# EAGLE schematic M7105B (EAGLE 6.6.0)

## Sheet 1 of 4
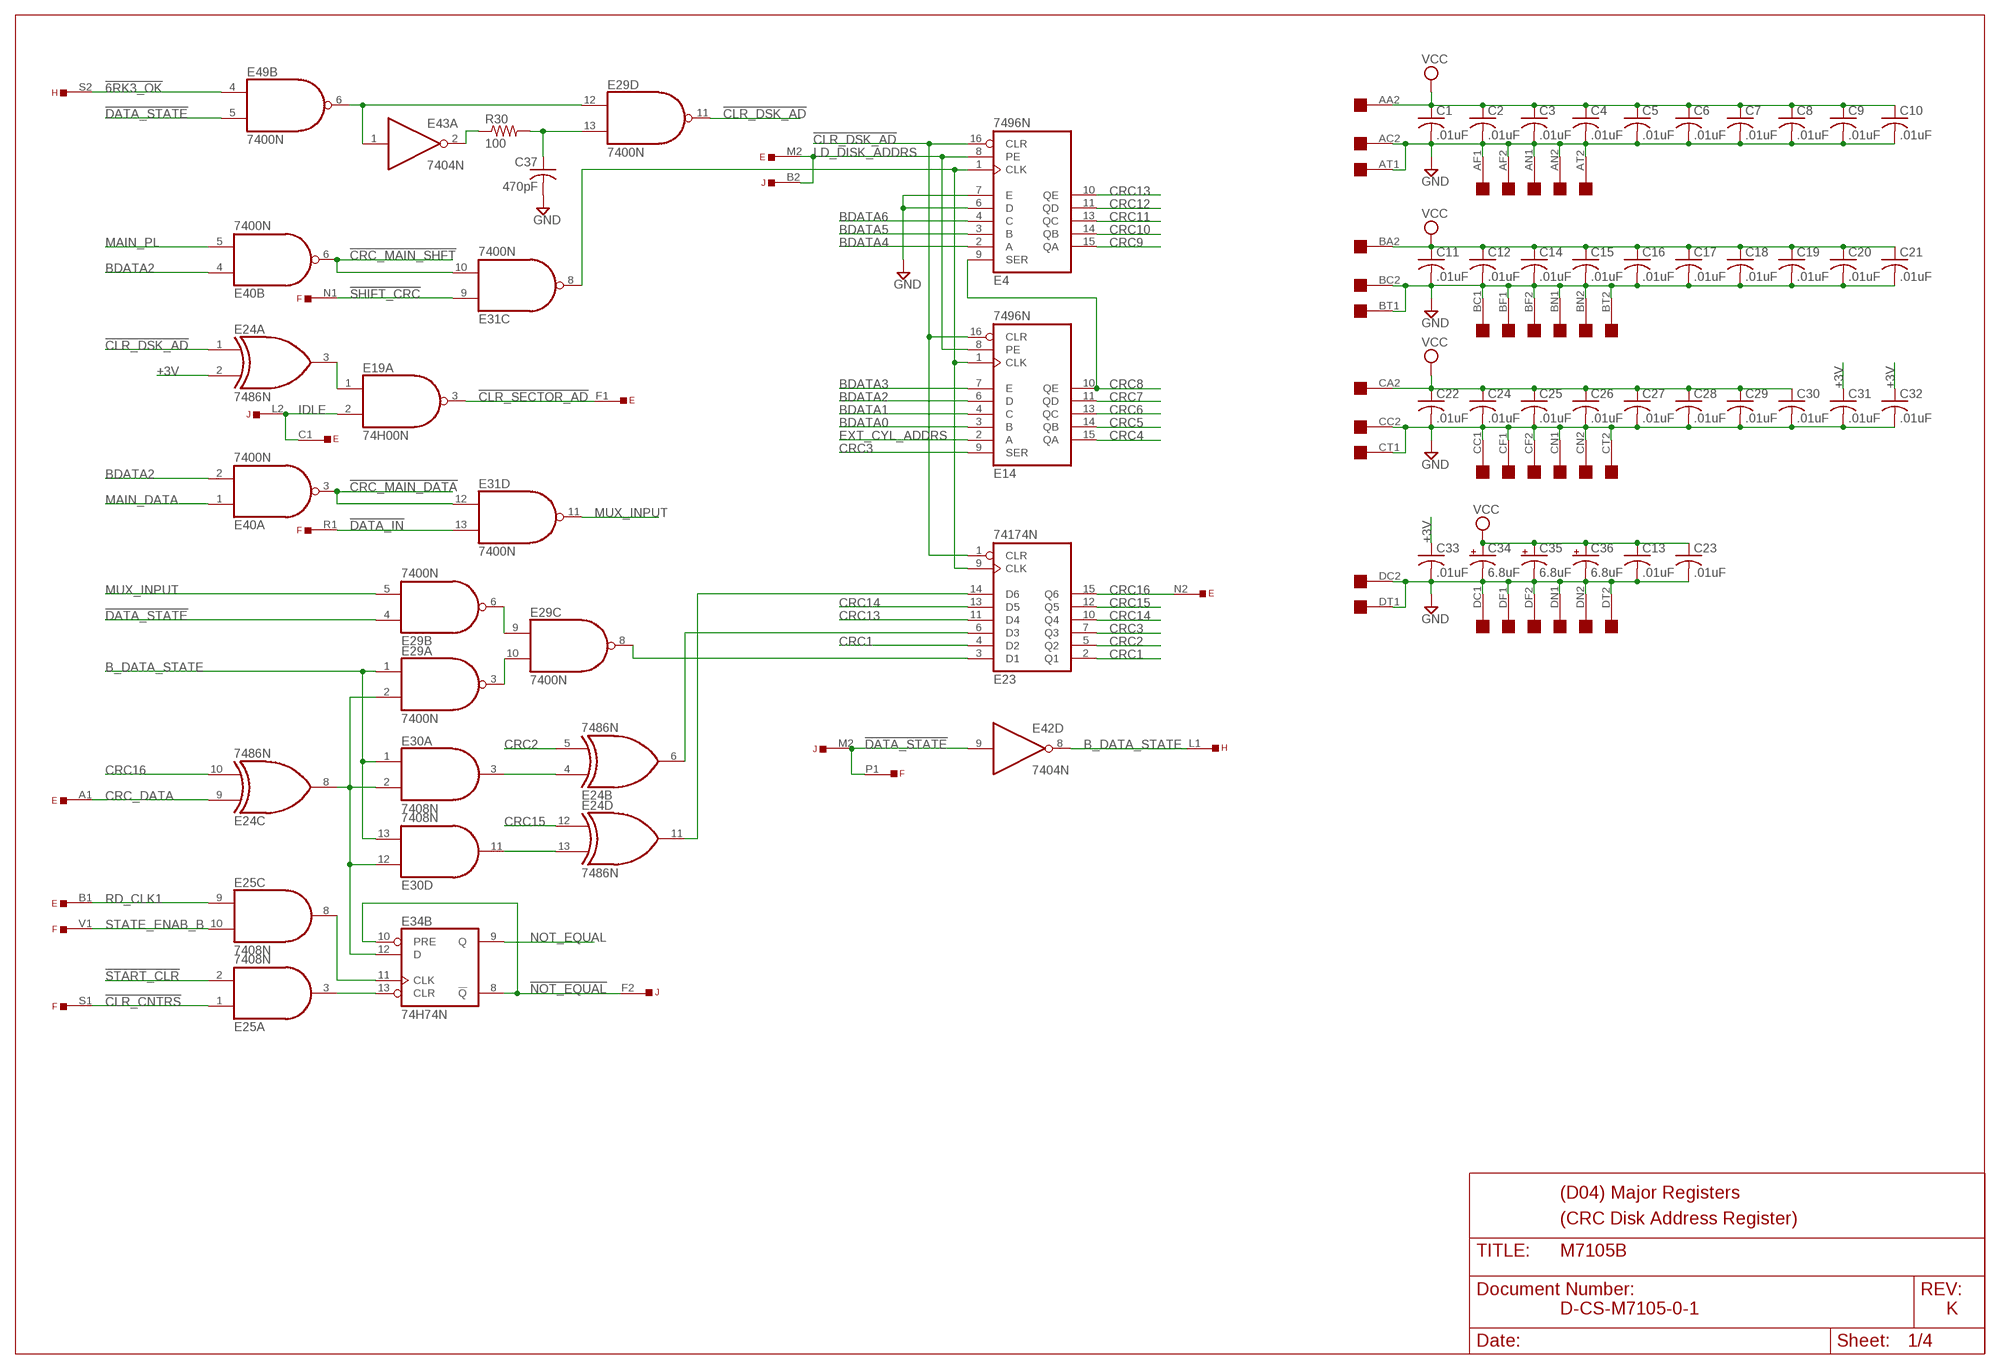
[diagram p0: schematic, sheet 1]

### Parts
C1  .01uF  C-US  [C063-025X075]
C2  .01uF  C-US  [C063-025X075]
C3  .01uF  C-US  [C063-025X075]
C4  .01uF  C-US  [C063-025X075]
C5  .01uF  C-US  [C063-025X075]
C6  .01uF  C-US  [C063-025X075]
C7  .01uF  C-US  [C063-025X075]
C8  .01uF  C-US  [C063-025X075]
C9  .01uF  C-US  [C063-025X075]
C10  .01uF  C-US  [C063-025X075]
C11  .01uF  C-US  [C063-025X075]
C12  .01uF  C-US  [C063-025X075]
C13  .01uF  C-US  [C063-025X075]
C14  .01uF  C-US  [C063-025X075]
C15  .01uF  C-US  [C063-025X075]
C16  .01uF  C-US  [C063-025X075]
C17  .01uF  C-US  [C063-025X075]
C18  .01uF  C-US  [C063-025X075]
C19  .01uF  C-US  [C063-025X075]
C20  .01uF  C-US  [C063-025X075]
C21  .01uF  C-US  [C063-025X075]
C22  .01uF  C-US  [C063-025X075]
C23  .01uF  C-US  [C063-025X075]
C24  .01uF  C-US  [C063-025X075]
C25  .01uF  C-US  [C063-025X075]
C26  .01uF  C-US  [C063-025X075]
C27  .01uF  C-US  [C063-025X075]
C28  .01uF  C-US  [C063-025X075]
C29  .01uF  C-US  [C063-025X075]
C30  .01uF  C-US  [C063-025X075]
C31  .01uF  C-US  [C063-025X075]
C32  .01uF  C-US  [C063-025X075]
C33  .01uF  C-US  [C063-025X075]
C34  6.8uF  CPOL-USE20-8AXIAL  [E12-8]
C35  6.8uF  CPOL-USE20-8AXIAL  [E12-8]
C36  6.8uF  CPOL-USE20-8AXIAL  [E12-8]
C37  470pF  C-US  [C063-025X075]
E  EDGE-TOP  [EDGE-CON2]
E4  7496N  74LS96N  [DIL16]
E14  7496N  74LS96N  [DIL16]
E19  74H00N  74S00N  [DIL14]
E23  74174N  [DIL16]
E24  7486N  [DIL14]
E25  7408N  74S08N  [DIL14]
E29  7400N  [DIL14]
E30  7408N  74S08N  [DIL14]
E31  7400N  [DIL14]
E34  74H74N  74S74N  [DIL14]
E40  7400N  [DIL14]
E42  7404N  [DIL14]
E43  7404N  [DIL14]
E49  7400N  [DIL14]
F  EDGE-TOP  [EDGE-CON2]
H  EDGE-TOP  [EDGE-CON2]
J  EDGE-TOP  [EDGE-CON2]
OMNIBUS  QUAD  [EDGE-CON8]
R30  100  R-US_0207/10  [0207/10]

### Nets
!6RK3_OK: E49.4(B:I0) H.S2
!CLR_CNTRS: E25.1(A:I0) F.S1
!CLR_DSK_AD: E4.16(CLR) E14.16(CLR) E23.1(CLR) E24.1(A:I0) E29.11(D:O)
!CLR_SECTOR_AD: E19.3(A:O) E.F1
!CRC_MAIN_DATA: E31.12(D:I0) E40.3(A:O)
!CRC_MAIN_SHFT: E31.10(C:I1) E40.6(B:O)
!DATA_IN: E31.13(D:I1) F.R1 ; also sheet 2
!DATA_STATE: E29.4(B:I0) E42.9(D:I) E49.5(B:I1) F.P1 J.M2
!NOT_EQUAL: E34.8(B:!Q) E34.10(B:PRE) J.F2
!SHIFT_CRC: E31.9(C:I0) F.N1
!START_CLR: E25.2(A:I1) ; also sheet 3
+3V: C31.1 C32.1 C33.1 E24.2(A:I1) ; also sheet 2,3
B_DATA_STATE: E29.1(A:I0) E30.1(A:I0) E30.13(D:I1) E42.8(D:O) H.L1
BDATA0: E14.3(B) ; also sheet 2,3
BDATA1: E14.4(C) ; also sheet 2,3
BDATA2: E14.6(D) E40.2(A:I1) E40.4(B:I0) ; also sheet 2,3
BDATA3: E14.7(E) ; also sheet 2,3
BDATA4: E4.2(A) ; also sheet 2,3
BDATA5: E4.3(B) ; also sheet 2,3
BDATA6: E4.4(C) ; also sheet 2,3
CRC1: E23.2(Q1) E23.4(D2)
CRC2: E23.5(Q2) E24.5(B:I1)
CRC3: E14.9(SER) E23.7(Q3)
CRC4: E14.15(QA) ; also sheet 4
CRC5: E14.14(QB) ; also sheet 4
CRC6: E14.13(QC) ; also sheet 4
CRC7: E14.11(QD) ; also sheet 4
CRC8: E4.9(SER) E14.10(QE) ; also sheet 4
CRC9: E4.15(QA) ; also sheet 4
CRC10: E4.14(QB) ; also sheet 4
CRC11: E4.13(QC) ; also sheet 4
CRC12: E4.11(QD)
CRC13: E4.10(QE) E23.11(D4)
CRC14: E23.10(Q4) E23.13(D5)
CRC15: E23.12(Q5) E24.12(D:I0)
CRC16: E23.15(Q6) E24.10(C:I1) E.N2 ; also sheet 2
CRC_DATA: E24.9(C:I0) E.A1
EXT_CYL_ADDRS: E14.2(A) ; also sheet 2
GND [supply]: C1.2 C2.2 C3.2 C4.2 C5.2 C6.2 C7.2 C8.2 C9.2 C10.2 C11.2 C12.2 C13.2 C14.2 C15.2 C16.2 C17.2 C18.2 C19.2 C20.2 C21.2 C22.2 C23.2 C24.2 C25.2 C26.2 C27.2 C28.2 C29.2 C30.2 C31.2 C32.2 C33.2 C34.- C35.- C36.- C37.2 E4.6(D) E4.7(E) OMNIBUS.AC2 OMNIBUS.AF1 OMNIBUS.AF2 OMNIBUS.AN1 OMNIBUS.AN2 OMNIBUS.AT1 OMNIBUS.AT2 OMNIBUS.BC1 OMNIBUS.BC2 OMNIBUS.BF1 OMNIBUS.BF2 OMNIBUS.BN1 OMNIBUS.BN2 OMNIBUS.BT1 OMNIBUS.BT2 OMNIBUS.CC1 OMNIBUS.CC2 OMNIBUS.CF1 OMNIBUS.CF2 OMNIBUS.CN1 OMNIBUS.CN2 OMNIBUS.CT1 OMNIBUS.CT2 OMNIBUS.DC1 OMNIBUS.DC2 OMNIBUS.DF1 OMNIBUS.DF2 OMNIBUS.DN1 OMNIBUS.DN2 OMNIBUS.DT1 OMNIBUS.DT2 ; also sheet 2,3,4
IDLE: E19.2(A:I1) E.C1 J.L2
LD_DISK_ADDRS: E4.8(PE) E14.8(PE) E.M2 J.B2 ; also sheet 3
MAIN_DATA: E40.1(A:I0) ; also sheet 2
MAIN_PL: E40.5(B:I1) ; also sheet 2,3
MUX_INPUT: E29.5(B:I1) E31.11(D:O)
N$2: E4.1(CLK) E14.1(CLK) E23.9(CLK) E31.8(C:O)
N$3: E29.6(B:O) E29.9(C:I0)
N$4: E43.2(A:O) R30.1
N$5: E29.3(A:O) E29.10(C:I1)
N$6: E24.8(C:O) E29.2(A:I1) E30.2(A:I1) E30.12(D:I0) E34.12(B:D)
N$7: E29.12(D:I0) E43.1(A:I) E49.6(B:O)
N$8: C37.1 E29.13(D:I1) R30.2
N$9: E19.1(A:I0) E24.3(A:O)
N$10: E24.4(B:I0) E30.3(A:O)
N$12: E24.13(D:I1) E30.11(D:O)
N$13: E25.3(A:O) E34.13(B:CLR)
N$14: E25.8(C:O) E34.11(B:CLK)
N$17: E23.14(D6) E24.11(D:O)
N$20: E23.6(D3) E24.6(B:O)
N$21: E23.3(D1) E29.8(C:O)
NOT_EQUAL: E34.9(B:Q)
RD_CLK1: E25.9(C:I0) E.B1
STATE_ENAB_B: E25.10(C:I1) F.V1
VCC [supply]: C1.1 C2.1 C3.1 C4.1 C5.1 C6.1 C7.1 C8.1 C9.1 C10.1 C11.1 C12.1 C13.1 C14.1 C15.1 C16.1 C17.1 C18.1 C19.1 C20.1 C21.1 C22.1 C23.1 C24.1 C25.1 C26.1 C27.1 C28.1 C29.1 C30.1 C34.+ C35.+ C36.+ OMNIBUS.AA2 OMNIBUS.BA2 OMNIBUS.CA2 ; also sheet 2,4
Unconnected: E19.4(B:I0) E19.5(B:I1) E19.6(B:O) E19.8(C:O) E19.9(C:I0) E19.10(C:I1) F.T1 H.F2 H.H2 H.J2 H.K2 J.T2 J.V1 J.V2 OMNIBUS.AA1 OMNIBUS.AB1 OMNIBUS.AB2 OMNIBUS.AC1 OMNIBUS.AJ2 OMNIBUS.AK1 OMNIBUS.AL1 OMNIBUS.AL2 OMNIBUS.AM1 OMNIBUS.AM2 OMNIBUS.AP1 OMNIBUS.AP2 OMNIBUS.AR2 OMNIBUS.AS2 OMNIBUS.AU2 OMNIBUS.AV2 OMNIBUS.BA1 OMNIBUS.BB1 OMNIBUS.BB2 OMNIBUS.BJ2 OMNIBUS.BK1 OMNIBUS.BK2 OMNIBUS.BL1 OMNIBUS.BM1 OMNIBUS.BM2 OMNIBUS.BP1 OMNIBUS.BP2 OMNIBUS.BR2 OMNIBUS.BS2 OMNIBUS.BU2 OMNIBUS.BV2 OMNIBUS.CA1 OMNIBUS.CB1 OMNIBUS.CB2 OMNIBUS.CD1 OMNIBUS.CE1 OMNIBUS.CE2 OMNIBUS.CH1 OMNIBUS.CH2 OMNIBUS.CJ1 OMNIBUS.CK1 OMNIBUS.CK2 OMNIBUS.CL1 OMNIBUS.CM1 OMNIBUS.CM2 OMNIBUS.CP1 OMNIBUS.CR1 OMNIBUS.CR2 OMNIBUS.CS1 OMNIBUS.CS2 OMNIBUS.CU2 OMNIBUS.CV2 OMNIBUS.DA1 OMNIBUS.DA2 OMNIBUS.DB1 OMNIBUS.DB2 OMNIBUS.DD2 OMNIBUS.DE2 OMNIBUS.DH2 OMNIBUS.DJ2 OMNIBUS.DK1 OMNIBUS.DK2 OMNIBUS.DL1 OMNIBUS.DL2 OMNIBUS.DM1 OMNIBUS.DM2 OMNIBUS.DP1 OMNIBUS.DP2 OMNIBUS.DR1 OMNIBUS.DR2 OMNIBUS.DS1 OMNIBUS.DS2 OMNIBUS.DU1 OMNIBUS.DU2 OMNIBUS.DV1 OMNIBUS.DV2

### Notes on the sheet
- (D04) Major Registers
- (CRC Disk Address Register)
- D-CS-M7105-0-1 | K

## Sheet 2 of 4
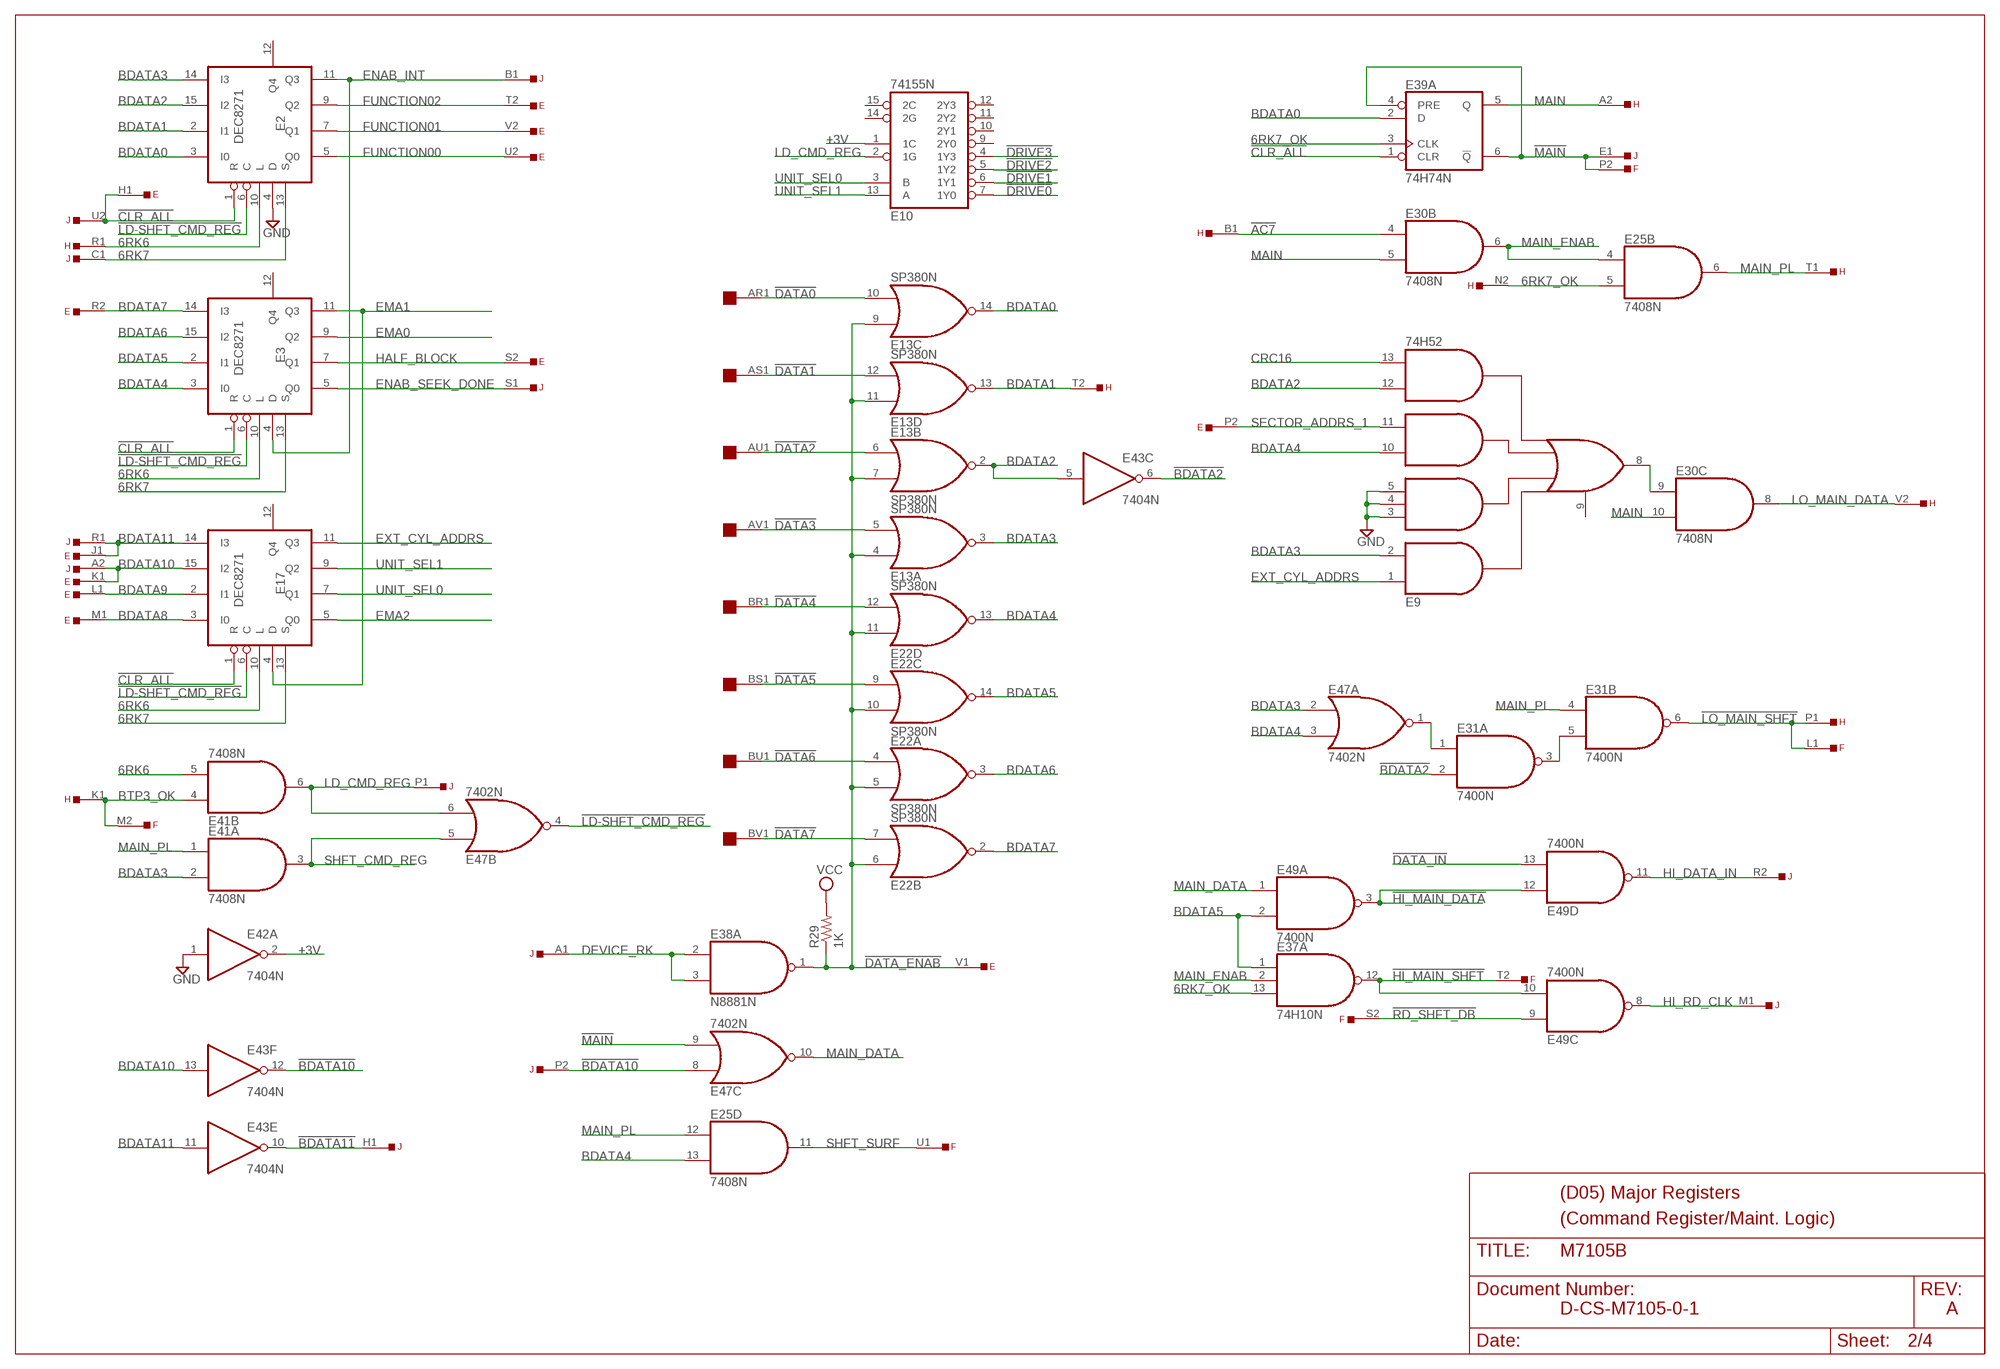
[diagram p1: schematic, sheet 2]

### Parts
E2  DEC8271  [DIL16]
E3  DEC8271  [DIL16]
E9  74H52  [DIL14]
E10  74155N  [DIL16]
E13  SP380N  [DIL14]
E17  DEC8271  [DIL16]
E22  SP380N  [DIL14]
E37  74H10N  7410N  [DIL14]
E38  N8881N  [DIL14]
E39  74H74N  74S74N  [DIL14]
E41  7408N  74S08N  [DIL14]
E47  7402N  [DIL14]
R29  1K  R-US_0207/10  [0207/10]

### Nets
6RK6: E2.10(L) E3.10(L) E17.10(L) E41.5(B:I1) H.R1
6RK7: E2.13(S) E3.13(S) E17.13(S) J.C1
6RK7_OK: E25.5(B:I1) E37.13(A:I2) E39.3(A:CLK) H.N2
!AC7: E30.4(B:I0) H.B1
!BDATA2: E31.2(A:I1) E43.6(C:O)
!BDATA10: E43.12(F:O) E47.8(C:I0) J.P2
!BDATA11: E43.10(E:O) J.H1
!CLR_ALL: E2.1(R) E3.1(R) E17.1(R) E39.1(A:CLR) E.H1 J.U2 ; also sheet 3
!DATA0: E13.10(C:I1) OMNIBUS.AR1 ; also sheet 3
!DATA1: E13.12(D:I1) OMNIBUS.AS1 ; also sheet 3
!DATA2: E13.6(B:I0) OMNIBUS.AU1
!DATA3: E13.5(A:I1) OMNIBUS.AV1
!DATA4: E22.12(D:I1) OMNIBUS.BR1
!DATA5: E22.9(C:I0) OMNIBUS.BS1
!DATA6: E22.4(A:I0) OMNIBUS.BU1
!DATA7: E22.7(B:I1) OMNIBUS.BV1
!DATA_ENAB: E13.4(A:I0) E13.7(B:I1) E13.9(C:I0) E13.11(D:I0) E22.5(A:I1) E22.6(B:I0) E22.10(C:I1) E22.11(D:I0) E38.1(A:O) E.V1 R29.1
!DATA_IN: E49.13(D:I1) ; also sheet 1
!DRIVE0: E10.7(1Y0) ; also sheet 4
!DRIVE1: E10.6(1Y1) ; also sheet 4
!DRIVE2: E10.5(1Y2) ; also sheet 4
!DRIVE3: E10.4(1Y3) ; also sheet 4
!HI_MAIN_DATA: E49.3(A:O) E49.12(D:I0)
!HI_MAIN_SHFT: E37.12(A:O) E49.10(C:I1) F.T2
!LD-SHFT_CMD_REG: E2.6(C) E3.6(C) E17.6(C) E47.4(B:O)
!LO_MAIN_SHFT: E31.6(B:O) F.L1 H.P1
!MAIN: E39.4(A:PRE) E39.6(A:!Q) E47.9(C:I1) F.P2 J.E1
!RD_SHFT_DB: E49.9(C:I0) F.S2
+3V: E10.1(1C) E42.2(A:O) ; also sheet 1,3
BDATA0: E2.3(I0) E13.14(C:O) E39.2(A:D) ; also sheet 1,3
BDATA1: E2.2(I1) E13.13(D:O) H.T2 ; also sheet 1,3
BDATA2: E2.15(I2) E9.12(I12) E13.2(B:O) E43.5(C:I) ; also sheet 1,3
BDATA3: E2.14(I3) E9.2(I2) E13.3(A:O) E41.2(A:I1) E47.2(A:I0) ; also sheet 1,3
BDATA4: E3.3(I0) E9.10(I10) E22.13(D:O) E25.13(D:I1) E47.3(A:I1) ; also sheet 1,3
BDATA5: E3.2(I1) E22.14(C:O) E37.1(A:I0) E49.2(A:I1) ; also sheet 1,3
BDATA6: E3.15(I2) E22.3(A:O) ; also sheet 1,3
BDATA7: E3.14(I3) E22.2(B:O) E.R2 ; also sheet 3
BDATA8: E17.3(I0) E.M1 ; also sheet 3
BDATA9: E17.2(I1) E.L1 ; also sheet 3
BDATA10: E17.15(I2) E43.13(F:I) E.K1 J.A2 ; also sheet 3
BDATA11: E17.14(I3) E43.11(E:I) E.J1 J.R1 ; also sheet 3
BTP3_OK: E41.4(B:I0) F.M2 H.K1 ; also sheet 3
CRC16: E9.13(I13) ; also sheet 1
DEVICE_RK: E38.2(A:I0) E38.3(A:I1) J.A1
EMA0: E3.9(Q2) ; also sheet 3
EMA1: E3.11(Q3) E17.4(D) ; also sheet 3
EMA2: E17.5(Q0) ; also sheet 3
ENAB_INT: E2.11(Q3) E3.4(D) J.B1
ENAB_SEEK_DONE: E3.5(Q0) J.S1
EXT_CYL_ADDRS: E9.1(I1) E17.11(Q3) ; also sheet 1
FUNCTION00: E2.5(Q0) E.U2
FUNCTION01: E2.7(Q1) E.V2
FUNCTION02: E2.9(Q2) E.T2
GND [supply]: E2.4(D) E9.3(I3) E9.4(I4) E9.5(I5) E42.1(A:I) ; also sheet 1,3,4
HALF_BLOCK: E3.7(Q1) E.S2
HI_DATA_IN: E49.11(D:O) J.R2
HI_RD_CLK: E49.8(C:O) J.M1
LD_CMD_REG: E10.2(1G) E41.6(B:O) E47.6(B:I1) J.P1
LO_MAIN_DATA: E30.8(C:O) H.V2
MAIN: E30.5(B:I1) E30.10(C:I1) E39.5(A:Q) H.A2 ; also sheet 3
MAIN_DATA: E47.10(C:O) E49.1(A:I0) ; also sheet 1
MAIN_ENAB: E25.4(B:I0) E30.6(B:O) E37.2(A:I1)
MAIN_PL: E25.6(B:O) E25.12(D:I0) E31.4(B:I0) E41.1(A:I0) H.T1 ; also sheet 1,3
N$1: E9.8(O8) E30.9(C:I0)
N$11: E31.1(A:I0) E47.1(A:O)
N$16: E31.3(A:O) E31.5(B:I1)
SECTOR_ADDRS_1: E9.11(I11) E.P2
SHFT_CMD_REG: E41.3(A:O) E47.5(B:I0)
SHFT_SURF: E25.11(D:O) F.U1
UNIT_SEL0: E10.3(B) E17.7(Q1)
UNIT_SEL1: E10.13(A) E17.9(Q2)
VCC [supply]: R29.2 ; also sheet 1,4
Unconnected: E2.12(Q4) E3.12(Q4) E9.6(NC) E9.9(I9) E10.9(2Y0) E10.10(2Y1) E10.11(2Y2) E10.12(2Y3) E10.14(2G) E10.15(2C) E17.12(Q4) E38.4(B:O) E38.5(B:I0) E38.6(B:I1)

### Notes on the sheet
- (D05) Major Registers
- (Command Register/Maint. Logic)
- D-CS-M7105-0-1 | A

## Sheet 3 of 4
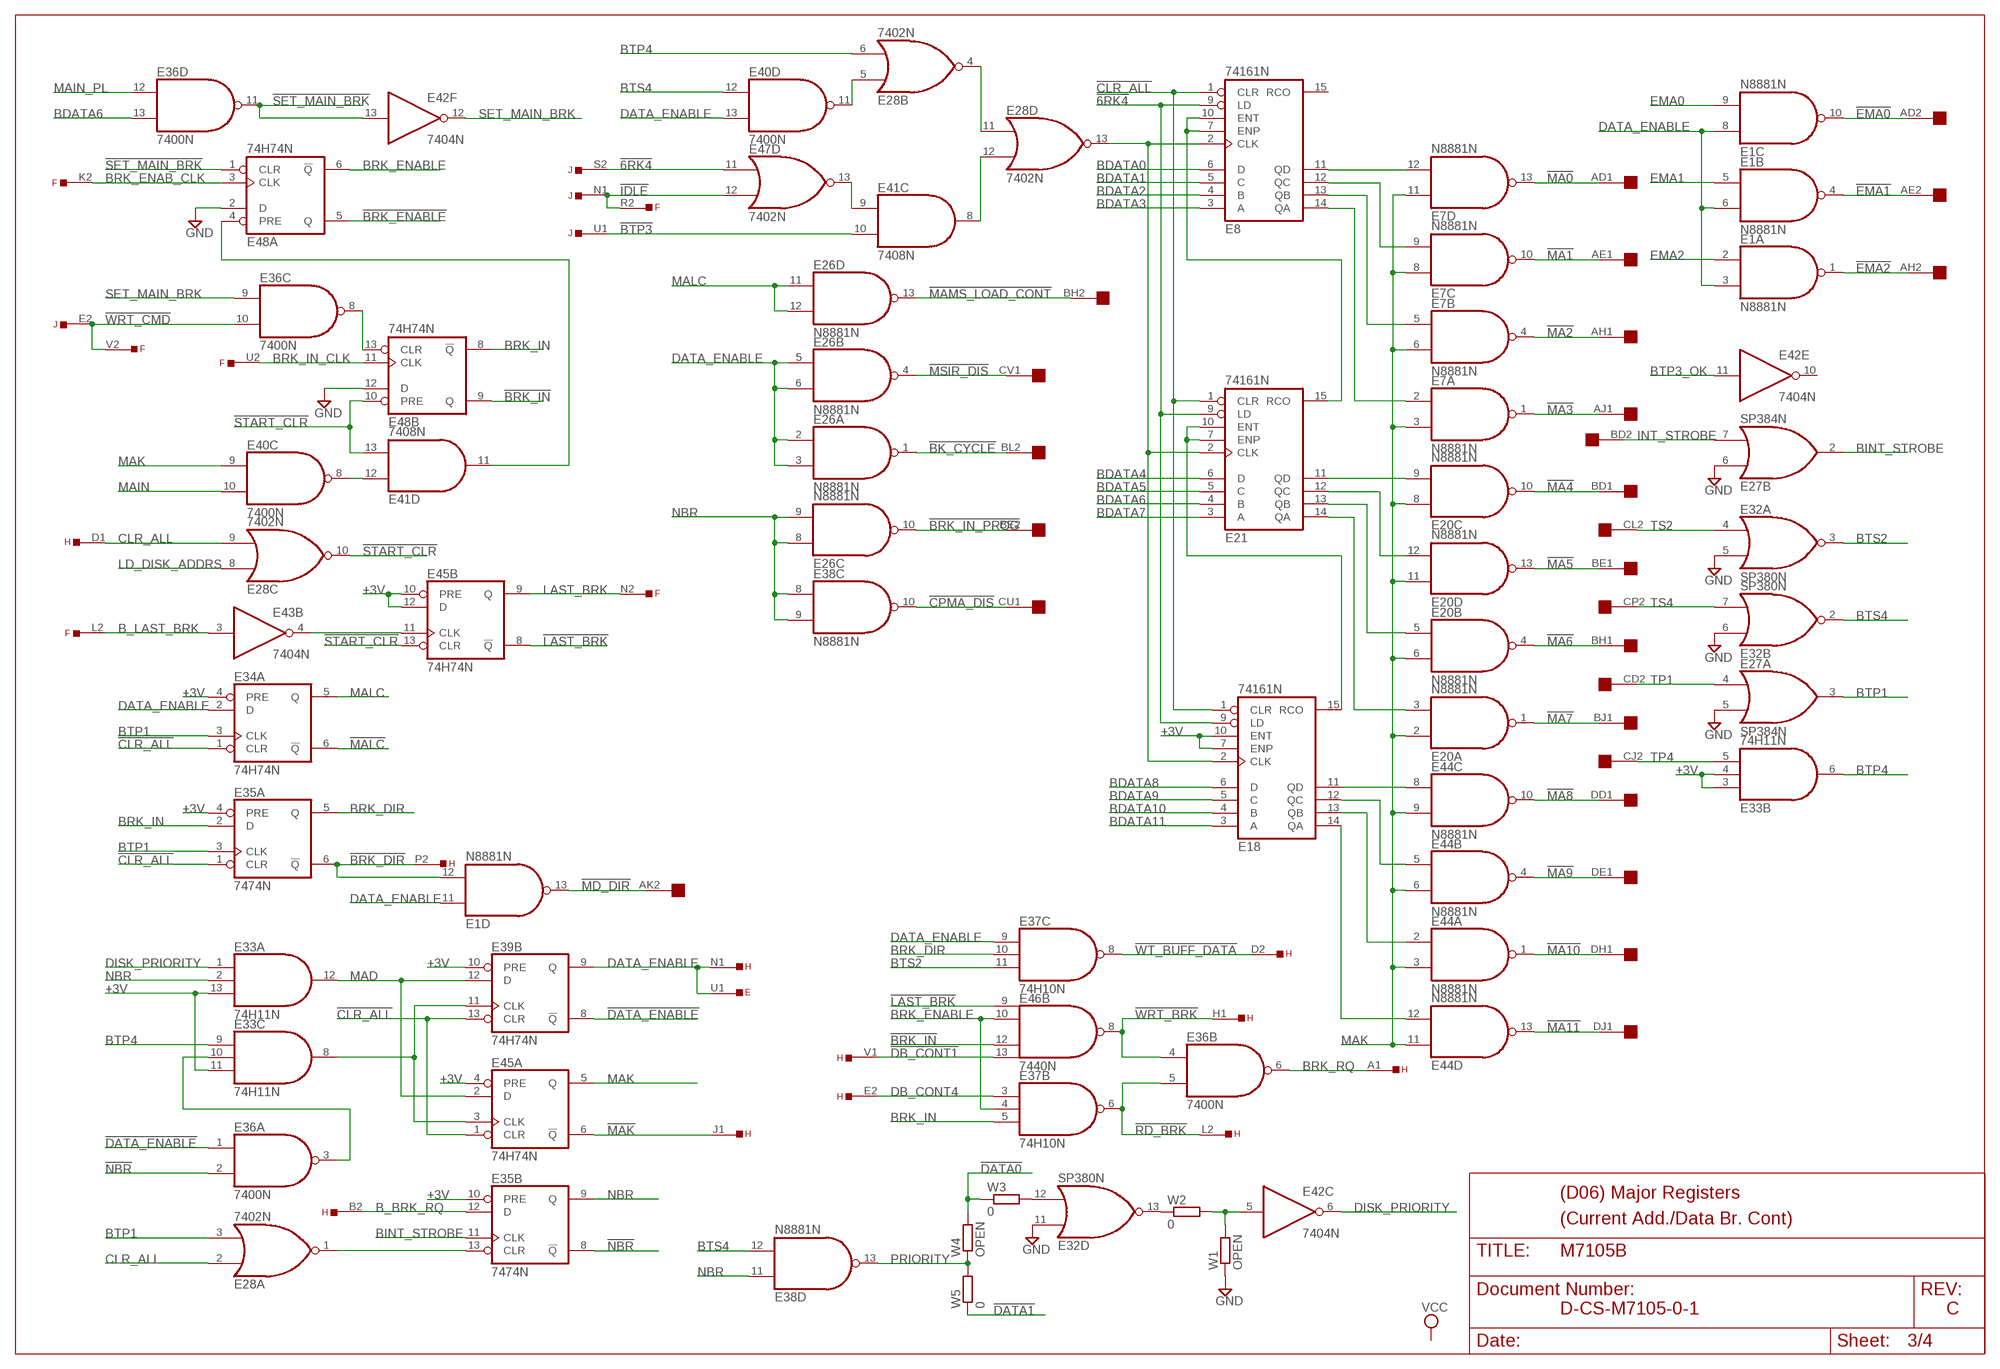
[diagram p2: schematic, sheet 3]

### Parts
E1  N8881N  [DIL14]
E7  N8881N  [DIL14]
E8  74161N  [DIL16]
E18  74161N  [DIL16]
E20  N8881N  [DIL14]
E21  74161N  [DIL16]
E26  N8881N  [DIL14]
E27  SP384N  [DIL14]
E28  7402N  [DIL14]
E32  SP380N  [DIL14]
E33  74H11N  74S11N  [DIL14]
E35  7474N  74S74N  [DIL14]
E36  7400N  [DIL14]
E44  N8881N  [DIL14]
E45  74H74N  74S74N  [DIL14]
E46  7440N  [DIL14]
E48  74H74N  74S74N  [DIL14]
W1  OPEN  R-EU_0204/7  [0204/7]
W2  0  R-EU_0204/7  [0204/7]
W3  0  R-EU_0204/5  [0204/5]
W4  OPEN  R-EU_0204/5  [0204/5]
W5  0  R-EU_0204/5  [0204/5]

### Nets
!6RK4: E8.9(LD) E18.9(LD) E21.9(LD) E47.11(D:I0) J.S2
!BK_CYCLE: E26.1(A:O) OMNIBUS.BL2
!BRK_DIR: E1.12(D:I1) E35.6(A:!Q) H.P2
!BRK_ENABLE: E48.5(A:Q)
!BRK_IN: E46.12(B:I2) E48.9(B:Q)
!BRK_IN_PROG: E26.10(C:O) OMNIBUS.BE2
!BTP3: E41.10(C:I1) J.U1
!CLR_ALL: E8.1(CLR) E18.1(CLR) E21.1(CLR) E34.1(A:CLR) E35.1(A:CLR) E39.13(B:CLR) E45.1(A:CLR) ; also sheet 2
!CPMA_DIS: E38.10(C:O) OMNIBUS.CU1
!DATA0: W3.1 W4.2 ; also sheet 2
!DATA1: W5.1 ; also sheet 2
!DATA_ENABLE: E36.1(A:I0) E39.8(B:!Q)
!DB_CONT1: E46.13(B:I3) H.V1
!EMA0: E1.10(C:O) OMNIBUS.AD2
!EMA1: E1.4(B:O) OMNIBUS.AE2
!EMA2: E1.1(A:O) OMNIBUS.AH2
!IDLE: E47.12(D:I1) F.R2 J.N1
!LAST_BRK: E45.8(B:!Q) E46.9(B:I0)
!MA0: E7.13(D:O) OMNIBUS.AD1
!MA1: E7.10(C:O) OMNIBUS.AE1
!MA2: E7.4(B:O) OMNIBUS.AH1
!MA3: E7.1(A:O) OMNIBUS.AJ1
!MA4: E20.10(C:O) OMNIBUS.BD1
!MA5: E20.13(D:O) OMNIBUS.BE1
!MA6: E20.4(B:O) OMNIBUS.BH1
!MA7: E20.1(A:O) OMNIBUS.BJ1
!MA8: E44.10(C:O) OMNIBUS.DD1
!MA9: E44.4(B:O) OMNIBUS.DE1
!MA10: E44.1(A:O) OMNIBUS.DH1
!MA11: E44.13(D:O) OMNIBUS.DJ1
!MAK: E45.6(A:!Q) H.J1
!MALC: E34.6(A:!Q)
!MAMS_LOAD_CONT: E26.13(D:O) OMNIBUS.BH2
!MD_DIR: E1.13(D:O) OMNIBUS.AK2
!MSIR_DIS: E26.4(B:O) OMNIBUS.CV1
!NBR: E35.8(B:!Q) E36.2(A:I1)
!RD_BRK: E36.5(B:I1) E37.6(B:O) H.L2
!SET_MAIN_BRK: E36.11(D:O) E42.13(F:I) E48.1(A:CLR)
!START_CLR: E28.10(C:O) E41.13(D:I1) E45.13(B:CLR) E48.10(B:PRE) ; also sheet 1
!WRT_BRK: E36.4(B:I0) E46.8(B:O) H.H1
!WRT_CMD: E36.10(C:I1) F.V2 J.E2
!WT_BUFF_DATA: E37.8(C:O) H.D2
+3V: E18.7(ENP) E18.10(ENT) E33.3(B:I0) E33.4(B:I1) E33.11(C:I2) E33.13(A:I2) E34.4(A:PRE) E35.4(A:PRE) E35.10(B:PRE) E39.10(B:PRE) E45.4(A:PRE) E45.10(B:PRE) E45.12(B:D) ; also sheet 1,2
B_BRK_RQ: E35.12(B:D) H.B2
B_LAST_BRK: E43.3(B:I) F.L2
BDATA0: E8.6(D) ; also sheet 1,2
BDATA1: E8.5(C) ; also sheet 1,2
BDATA2: E8.4(B) ; also sheet 1,2
BDATA3: E8.3(A) ; also sheet 1,2
BDATA4: E21.6(D) ; also sheet 1,2
BDATA5: E21.5(C) ; also sheet 1,2
BDATA6: E21.4(B) E36.13(D:I1) ; also sheet 1,2
BDATA7: E21.3(A) ; also sheet 2
BDATA8: E18.6(D) ; also sheet 2
BDATA9: E18.5(C) ; also sheet 2
BDATA10: E18.4(B) ; also sheet 2
BDATA11: E18.3(A) ; also sheet 2
BINT_STROBE: E27.2(B:O) E35.11(B:CLK)
BRK_DIR: E35.5(A:Q) E37.10(C:I1)
BRK_ENAB_CLK: E48.3(A:CLK) F.K2
BRK_ENABLE: E37.4(B:I1) E46.10(B:I1) E48.6(A:!Q)
BRK_IN: E35.2(A:D) E37.5(B:I2) E48.8(B:!Q)
BRK_IN_CLK: E48.11(B:CLK) F.U2
BRK_RQ: E36.6(B:O) H.A1
BTP1: E27.3(A:O) E28.3(A:I1) E34.3(A:CLK) E35.3(A:CLK)
BTP3_OK: E42.11(E:I) ; also sheet 2
BTP4: E28.6(B:I1) E33.6(B:O) E33.9(C:I0)
BTS2: E32.3(A:O) E37.11(C:I2)
BTS4: E32.2(B:O) E38.12(D:I1) E40.12(D:I0)
CLR_ALL: E28.2(A:I0) E28.9(C:I1) H.D1
DATA_ENABLE: E1.3(A:I1) E1.6(B:I1) E1.8(C:I0) E1.11(D:I0) E26.2(A:I0) E26.3(A:I1) E26.5(B:I0) E26.6(B:I1) E34.2(A:D) E37.9(C:I0) E39.9(B:Q) E40.13(D:I1) E.U1 H.N1
DB_CONT4: E37.3(B:I0) H.E2
DISK_PRIORITY: E33.1(A:I0) E42.6(C:O)
EMA0: E1.9(C:I1) ; also sheet 2
EMA1: E1.5(B:I0) ; also sheet 2
EMA2: E1.2(A:I0) ; also sheet 2
GND [supply]: E27.5(A:I1) E27.6(B:I0) E32.5(A:I1) E32.6(B:I0) E32.11(D:I0) E48.2(A:D) E48.12(B:D) W1.1 ; also sheet 1,2,4
INT_STROBE: E27.7(B:I1) OMNIBUS.BD2
LAST_BRK: E45.9(B:Q) F.N2
LD_DISK_ADDRS: E28.8(C:I0) ; also sheet 1
MAD: E33.12(A:O) E39.12(B:D) E45.2(A:D)
MAIN: E40.10(C:I1) ; also sheet 2
MAIN_PL: E36.12(D:I0) ; also sheet 1,2
MAK: E7.3(A:I1) E7.6(B:I1) E7.8(C:I0) E7.11(D:I0) E20.2(A:I0) E20.6(B:I1) E20.8(C:I0) E20.11(D:I0) E40.9(C:I0) E44.3(A:I1) E44.6(B:I1) E44.9(C:I1) E44.11(D:I0) E45.5(A:Q)
MALC: E26.11(D:I0) E26.12(D:I1) E34.5(A:Q)
N$15: E43.4(B:O) E45.11(B:CLK)
N$18: E18.15(RCO) E21.7(ENP) E21.10(ENT)
N$19: E8.7(ENP) E8.10(ENT) E21.15(RCO)
N$22: E28.4(B:O) E28.11(D:I0)
N$23: E28.12(D:I1) E41.8(C:O)
N$24: E28.5(B:I0) E40.11(D:O)
N$25: E41.9(C:I0) E47.13(D:O)
N$26: E7.12(D:I1) E8.11(QD)
N$27: E42.5(C:I) W1.2 W2.2
N$29: E8.2(CLK) E18.2(CLK) E21.2(CLK) E28.13(D:O)
N$30: E32.13(D:O) W2.1
N$31: E32.12(D:I1) W3.2
N$32: E36.8(C:O) E48.13(B:CLR)
N$33: E41.11(D:O) E48.4(A:PRE)
N$34: E33.10(C:I1) E36.3(A:O)
N$35: E40.8(C:O) E41.12(D:I0)
N$37: E7.9(C:I1) E8.12(QC)
N$38: E7.5(B:I0) E8.13(QB)
N$39: E7.2(A:I0) E8.14(QA)
N$40: E20.9(C:I1) E21.11(QD)
N$41: E20.5(B:I0) E21.13(QB)
N$42: E18.11(QD) E44.8(C:I0)
N$43: E20.12(D:I1) E21.12(QC)
N$44: E18.13(QB) E44.2(A:I0)
N$45: E18.12(QC) E44.5(B:I0)
N$47: E18.14(QA) E44.12(D:I1)
N$48: E20.3(A:I1) E21.14(QA)
N$49: E28.1(A:O) E35.13(B:CLR)
N$55: E33.8(C:O) E39.11(B:CLK) E45.3(A:CLK)
NBR: E26.8(C:I0) E26.9(C:I1) E33.2(A:I1) E35.9(B:Q) E38.8(C:I0) E38.9(C:I1) E38.11(D:I0)
PRIORITY: E38.13(D:O) W4.1 W5.2
SET_MAIN_BRK: E36.9(C:I0) E42.12(F:O)
TP1: E27.4(A:I0) OMNIBUS.CD2
TP4: E33.5(B:I2) OMNIBUS.CJ2
TS2: E32.4(A:I0) OMNIBUS.CL2
TS4: E32.7(B:I1) OMNIBUS.CP2
Unconnected: E8.15(RCO) E27.9(C:I0) E27.10(C:I1) E27.11(D:I0) E27.12(D:I1) E27.13(D:O) E27.14(C:O) E42.10(E:O) E46.1(A:I0) E46.2(A:I1) E46.3(3:NC) E46.4(A:I2) E46.5(A:I3) E46.6(A:O) E46.11(11:NC)

### Notes on the sheet
- (D06) Major Registers
- (Current Add./Data Br. Cont)
- D-CS-M7105-0-1 | C

## Sheet 4 of 4
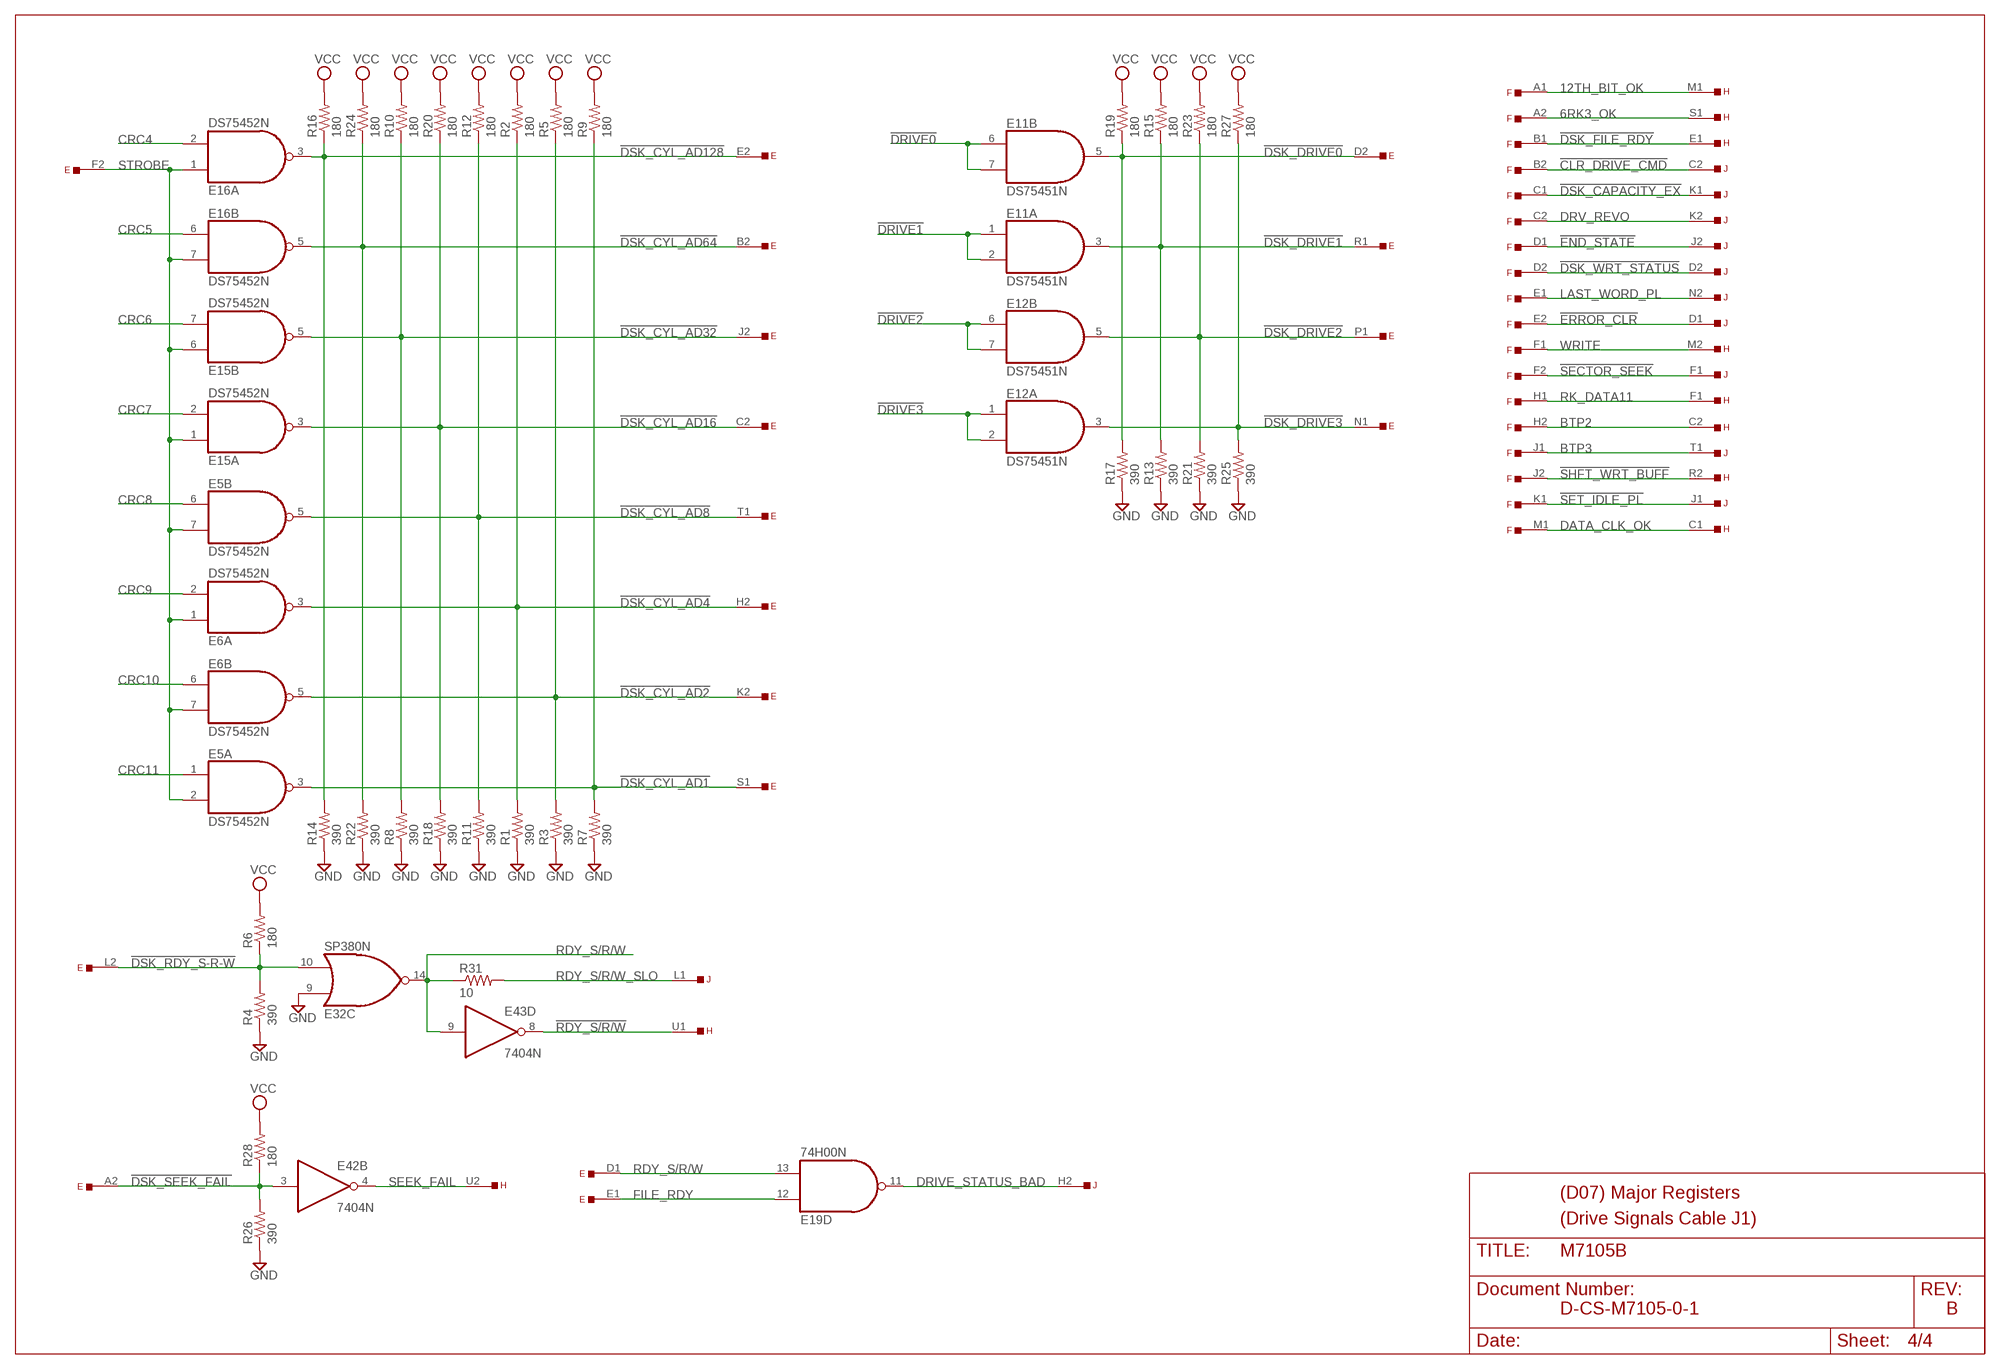
[diagram p3: schematic, sheet 4]

### Parts
E5  DS75452N  [DIL08]
E6  DS75452N  [DIL08]
E11  DS75451N  [DIL08]
E12  DS75451N  [DIL08]
E15  DS75452N  [DIL08]
E16  DS75452N  [DIL08]
R1  390  R-US_0207/10  [0207/10]
R2  180  R-US_0207/10  [0207/10]
R3  390  R-US_0207/10  [0207/10]
R4  390  R-US_0207/10  [0207/10]
R5  180  R-US_0207/10  [0207/10]
R6  180  R-US_0207/10  [0207/10]
R7  390  R-US_0207/10  [0207/10]
R8  390  R-US_0207/10  [0207/10]
R9  180  R-US_0207/10  [0207/10]
R10  180  R-US_0207/10  [0207/10]
R11  390  R-US_0207/10  [0207/10]
R12  180  R-US_0207/10  [0207/10]
R13  390  R-US_0207/10  [0207/10]
R14  390  R-US_0207/10  [0207/10]
R15  180  R-US_0207/10  [0207/10]
R16  180  R-US_0207/10  [0207/10]
R17  390  R-US_0207/10  [0207/10]
R18  390  R-US_0207/10  [0207/10]
R19  180  R-US_0207/10  [0207/10]
R20  180  R-US_0207/10  [0207/10]
R21  390  R-US_0207/10  [0207/10]
R22  390  R-US_0207/10  [0207/10]
R23  180  R-US_0207/10  [0207/10]
R24  180  R-US_0207/10  [0207/10]
R25  390  R-US_0207/10  [0207/10]
R26  390  R-US_0207/10  [0207/10]
R27  180  R-US_0207/10  [0207/10]
R28  180  R-US_0207/10  [0207/10]
R31  10  R-US_0207/10  [0207/10]

### Nets
6RK3_OK: F.A2 H.S1
12TH_BIT_OK: F.A1 H.M1
!CLR_DRIVE_CMD: F.B2 J.C2
!DRIVE0: E11.6(B:I0) E11.7(B:I1) ; also sheet 2
!DRIVE1: E11.1(A:I0) E11.2(A:I1) ; also sheet 2
!DRIVE2: E12.6(B:I0) E12.7(B:I1) ; also sheet 2
!DRIVE3: E12.1(A:I0) E12.2(A:I1) ; also sheet 2
!DSK_CAPACITY_EX: F.C1 J.K1
!DSK_CYL_AD1: E5.3(A:O) E.S1 R7.2 R9.1
!DSK_CYL_AD2: E6.5(B:O) E.K2 R3.2 R5.1
!DSK_CYL_AD4: E6.3(A:O) E.H2 R1.2 R2.1
!DSK_CYL_AD8: E5.5(B:O) E.T1 R11.2 R12.1
!DSK_CYL_AD16: E15.3(A:O) E.C2 R18.2 R20.1
!DSK_CYL_AD32: E15.5(B:O) E.J2 R8.2 R10.1
!DSK_CYL_AD64: E16.5(B:O) E.B2 R22.2 R24.1
!DSK_CYL_AD128: E16.3(A:O) E.E2 R14.2 R16.1
!DSK_DRIVE0: E11.5(B:O) E.D2 R17.2 R19.1
!DSK_DRIVE1: E11.3(A:O) E.R1 R13.2 R15.1
!DSK_DRIVE2: E12.5(B:O) E.P1 R21.2 R23.1
!DSK_DRIVE3: E12.3(A:O) E.N1 R25.2 R27.1
!DSK_FILE_RDY: F.B1 H.E1
!DSK_RDY_S-R-W: E32.10(C:I1) E.L2 R4.2 R6.1
!DSK_SEEK_FAIL: E42.3(B:I) E.A2 R26.2 R28.1
!DSK_WRT_STATUS: F.D2 J.D2
!END_STATE: F.D1 J.J2
!ERROR_CLR: F.E2 J.D1
!RDY_S/R/W: E43.8(D:O) H.U1
!SECTOR_SEEK: F.F2 J.F1
!SET_IDLE_PL: F.K1 J.J1
!SHFT_WRT_BUFF: F.J2 H.R2
BTP2: F.H2 H.C2
BTP3: F.J1 J.T1
CRC4: E16.2(A:I1) ; also sheet 1
CRC5: E16.6(B:I0) ; also sheet 1
CRC6: E15.7(B:I1) ; also sheet 1
CRC7: E15.2(A:I1) ; also sheet 1
CRC8: E5.6(B:I0) ; also sheet 1
CRC9: E6.2(A:I1) ; also sheet 1
CRC10: E6.6(B:I0) ; also sheet 1
CRC11: E5.1(A:I0) ; also sheet 1
DATA_CLK_OK: F.M1 H.C1
DRIVE_STATUS_BAD: E19.11(D:O) J.H2
DRV_REVO: F.C2 J.K2
FILE_RDY: E19.12(D:I0) E.E1
GND [supply]: E32.9(C:I0) R1.1 R3.1 R4.1 R7.1 R8.1 R11.1 R13.1 R14.1 R17.1 R18.1 R21.1 R22.1 R25.1 R26.1 ; also sheet 1,2,3
LAST_WORD_PL: F.E1 J.N2
RDY_S/R/W: E19.13(D:I1) E32.14(C:O) E43.9(D:I) E.D1 R31.1
RDY_S/R/W_SLO: J.L1 R31.2
RK_DATA11: F.H1 H.F1
SEEK_FAIL: E42.4(B:O) H.U2
STROBE: E5.2(A:I1) E5.7(B:I1) E6.1(A:I0) E6.7(B:I1) E15.1(A:I0) E15.6(B:I0) E16.1(A:I0) E16.7(B:I1) E.F2
VCC [supply]: R2.2 R5.2 R6.2 R9.2 R10.2 R12.2 R15.2 R16.2 R19.2 R20.2 R23.2 R24.2 R27.2 R28.2 ; also sheet 1,2
WRITE: F.F1 H.M2

### Notes on the sheet
- (D07) Major Registers
- (Drive Signals Cable J1)
- D-CS-M7105-0-1 | B

## Power pins joined to a net without a drawn wire
GND: E1.7(P:GND) E2.8(GND) E3.8(GND) E4.12(GND) E5.4(P:GND) E6.4(P:GND) E7.7(P:GND) E8.8(GND) E9.7(GND) E10.8(GND) E11.4(PWR:GND) E12.4(PWR:GND) E13.1(P:GND) E14.12(GND) E15.4(P:GND) E16.4(P:GND) E17.8(GND) E18.8(GND) E19.7(P:GND) E20.7(P:GND) E21.8(GND) E22.1(P:GND) E23.8(GND) E24.7(P:GND) E25.7(P:GND) E26.7(P:GND) E27.1(GND) E28.7(P:GND) E29.7(P:GND) E30.7(P:GND) E31.7(P:GND) E32.1(P:GND) E33.7(P:GND) E34.7(P:GND) E35.7(P:GND) E36.7(P:GND) E37.7(P:GND) E38.7(P:GND) E39.7(P:GND) E40.7(P:GND) E41.7(P:GND) E42.7(P:GND) E43.7(P:GND) E44.7(P:GND) E45.7(P:GND) E46.7(P:GND) E47.7(P:GND) E48.7(P:GND) E49.7(P:GND)
VCC: E1.14(P:VCC) E2.16(VCC) E3.16(VCC) E4.5(VCC) E5.8(P:VCC) E6.8(P:VCC) E7.14(P:VCC) E8.16(VCC) E9.14(VCC) E10.16(VCC) E11.8(PWR:VCC) E12.8(PWR:VCC) E13.8(P:VCC) E14.5(VCC) E15.8(P:VCC) E16.8(P:VCC) E17.16(VCC) E18.16(VCC) E19.14(P:VCC) E20.14(P:VCC) E21.16(VCC) E22.8(P:VCC) E23.16(VCC) E24.14(P:VCC) E25.14(P:VCC) E26.14(P:VCC) E27.8(VCC) E28.14(P:VCC) E29.14(P:VCC) E30.14(P:VCC) E31.14(P:VCC) E32.8(P:VCC) E33.14(P:VCC) E34.14(P:VCC) E35.14(P:VCC) E36.14(P:VCC) E37.14(P:VCC) E38.14(P:VCC) E39.14(P:VCC) E40.14(P:VCC) E41.14(P:VCC) E42.14(P:VCC) E43.14(P:VCC) E44.14(P:VCC) E45.14(P:VCC) E46.14(P:VCC) E47.14(P:VCC) E48.14(P:VCC) E49.14(P:VCC)

## Library data of the parts
C1-C33 C37 = dec-con:C-US: Capacitor with funky DEC lead spacing.
C34-C36 = dec-con:CPOL-USE20-8AXIAL: A 0.8 inch electrolytic.
E F H J = dec-con:EDGE-TOP: Labeled DEC edge connector, suitable for top connector.
E1 E7 E20 E26 E38 E44 = dec-con:N8881: Quad 2-input NAND gate, open collector
E2 E3 E17 = dec-con:DEC8271: Parallel Load Shift Register
E4 E14 = 74xx-us:74*96: 5-bit SHIFT REGISTER
E5 E6 E15 E16 = dec-con:DS75452: Quad 2-input NAND gate, open collector output
E8 E18 E21 = dec-con:74*161: Synchronous 4-bit COUNTER
E9 = dec-con:74*52: Expandable 2-2-2-3 Input AND-OR gate.
E10 = 74xx-us:74*155: Dual 2-line to 4-line data DECODER/DEMULTIPLEXER
E11 E12 = dec-con:DS75451
E13 E22 E32 = dec-con:SP380: Quad NOR gate (use 8640)
E19 E29 E31 E36 E40 E49 = 74xx-us:74*00: Quad 2-input NAND gate
E23 = 74xx-us:74*174: Hex D type FLIP FLOP, clear
E24 = 74xx-us:74*86: Quad 2-input EXCLUSIV-OR (XOR) gate
E25 E30 E41 = 74xx-us:74*08: Quad 2-input AND gate
E27 = dec-con:SP384: Quad OR gate
E28 E47 = 74xx-us:74*02: Quad 2-input NOR gate
E33 = 74xx-us:74*11: Triple 3-input AND gate
E34 E35 E39 E45 E48 = 74xx-us:74*74: Dual D type positive edge triggered FLIP FLOP, preset and clear
E37 = 74xx-us:74*10: Triple 3-input NAND gate
E42 E43 = 74xx-us:74*04: Hex INVERTER
E46 = dec-con:74*40: Dual 4-input NAND gate
OMNIBUS = dec-con:QUAD: Quad-Height DEC board
R1-R31 = rcl:R-US_: RESISTOR, American symbol
W1-W5 = rcl:R-EU_: RESISTOR, European symbol

## Net classes
1 supply: width 0.813 mm